# Altium project Segger_DebugBoard_v3.PrjPcb
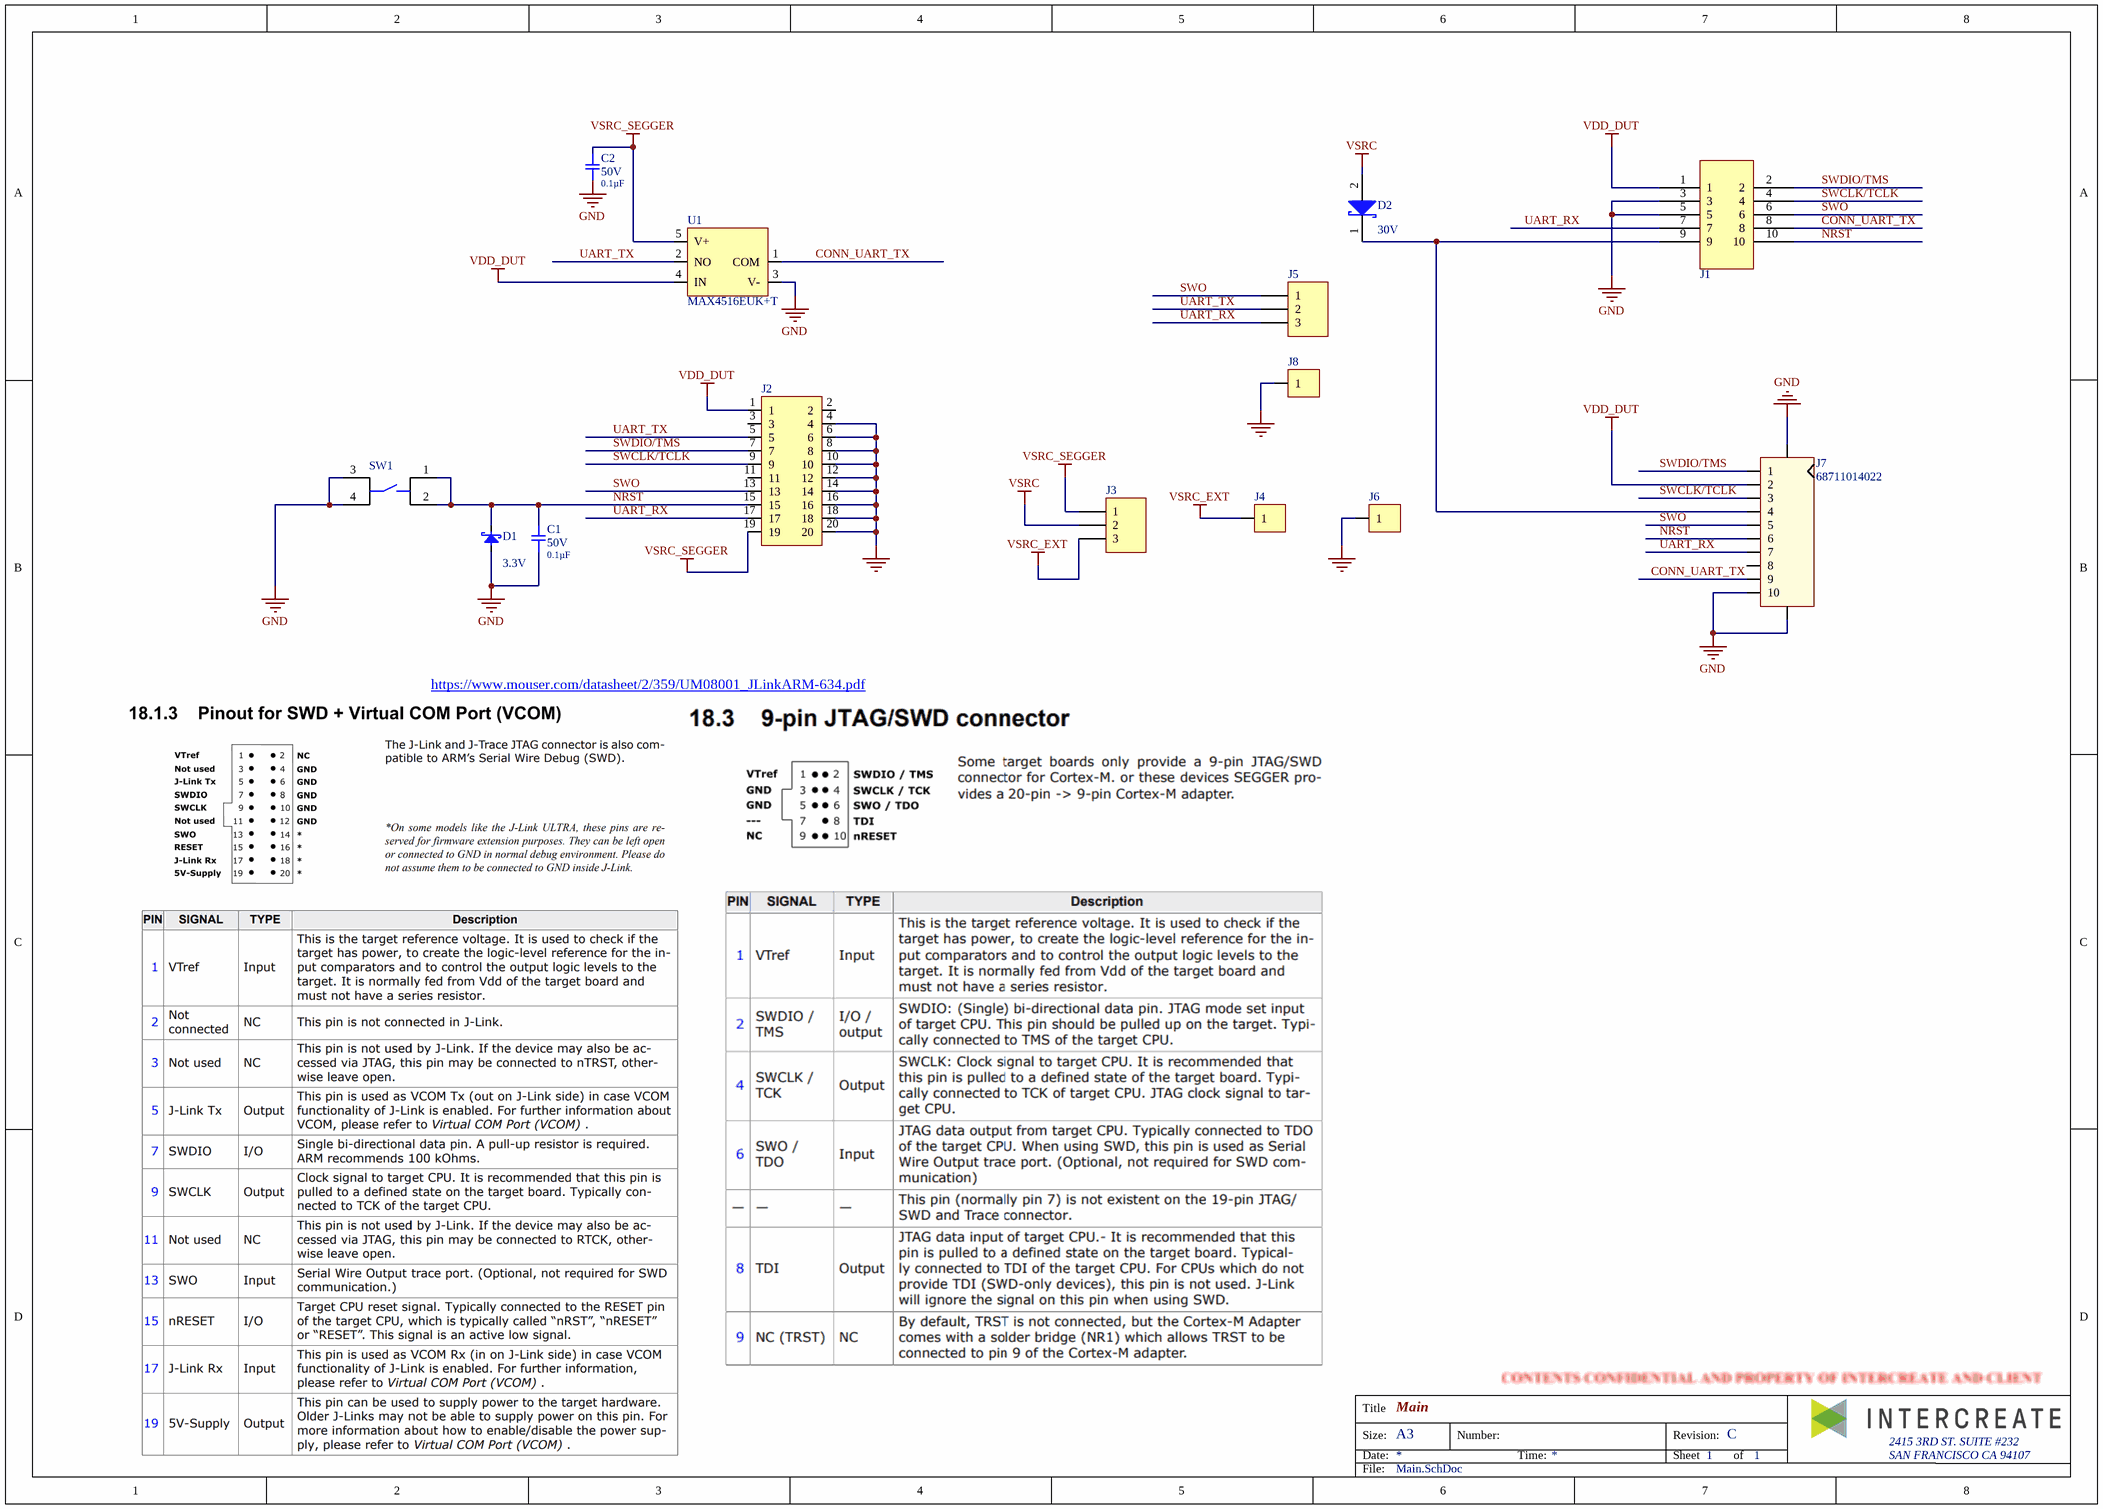
[diagram p0: Main.SchDoc]
Rev: C; ProjectName: Segger_DebugBoard
1 sheet, 14 parts. Net scope: global (net labels, ports and power ports of the same name join across sheets).
Board file: DebugBoard_v3.PcbDoc

## Sheet Main.SchDoc: Main
size A3; Organization: INTERCREATE; Address1: 2415 3RD ST. SUITE #232; Address2: SAN FRANCISCO CA 94107; Revision: C; SheetNumber: 1; SheetTotal: 1; ProjectName: KAGWERKS COMMAND CENTER

### Parts
C1  value 0.1µF  Voltage Rating: 50V  [CAP-0402]  (hidden comment: GCM155R71H104KE02D)
C2  value 0.1µF  Voltage Rating: 50V  [CAP-0402]  (hidden comment: GCM155R71H104KE02D)
D1  Reverse Standoff Voltage: 3.3V  [DIODE-SOD923f]  (hidden comment: CPDQ3V3U-HF)
D2  Reverse Voltage: 30V  [DIODE-SOD128]  (hidden comment: PMEG3010EP,115)
J1  FTSH-105-01-L-DV-K  [HDR-V-2X5-M]  (value not drawn)
J2  SFH11-PBPC-D10-ST-BK  [HDR-V-2X10-F-2.54MM]  (value not drawn)
J3  61300311121  [HDR-V-1X3]  (value not drawn)
J4  75160-101-01LF  [HDR-V-1X1-M]  (value not drawn)
J5  61300311121  [HDR-V-1X3]  (value not drawn)
J6  75160-101-01LF  [HDR-V-1X1-M]  (value not drawn)
J7  68711014022  [CONN-R-FPC-10P-WURTH]
J8  75160-101-01LF  [HDR-V-1X1-M]  (value not drawn)
SW1  PTS645SK50SMTR92 LFS  [BTN-SPST-PTS645SK50SMTR92]  (value not drawn)
U1  MAX4516EUK+T  [IC-SOT-23-5]

### Nets
GND: C1.1 C2.1 D1.2(A) J1.3 J1.5 J2.4 J2.6 J2.8 J2.10 J2.12 J2.14 J2.16 J2.18 J2.20 J6.1 J7.10 J7.ME1 J7.ME2 J8.1 SW1.3 SW1.4 U1.3(V-)
VDD_DUT: J1.1 J2.1 J7.2 U1.4(IN)
VSRC: D2.2(A) J3.2
VSRC_EXT: J3.3 J4.1
VSRC_SEGGER: C2.2 J2.19 J3.1 U1.5(V+)
CONN_UART_TX: J1.8 J7.9 U1.1(COM)
NRST: C1.2 D1.1(K) J1.10 J2.15 J7.6 SW1.1 SW1.2
SWCLK/TCLK: J1.4 J2.9 J7.3
SWDIO/TMS: J1.2 J2.7 J7.1
SWO: J1.6 J2.13 J5.1 J7.5
UART_RX: J1.7 J2.17 J5.3 J7.7
UART_TX: J2.5 J5.2 U1.2(NO)
NetD2_1: D2.1(K) J1.9 J7.4

Not connected (* = marked no-connect by the designer): J2 2 3 11; J7 8

### Notes on the sheet
- https://www.mouser.com/datasheet/2/359/UM08001_JLinkARM-634.pdf
- Title
- Size:
- Date:
- A3
- Number:
- Time:
- Revision:
- Sheet
- of
- File:

### Library data of the parts
C1 C2 = CAP-0.1uF-50V-0402: CAP CER 0.1UF 50V X7R 0402 10%; Manufacturer 1: Murata; Capacitance: 100nF; Supplier 1: Digi-Key; Manufacturer Part Number 1: GCM155R71H104KE02D; Stock 1: 254896; Pricing 1: 1=0.10000, 10=0.06100, 100=0.02730, 500=0.01952, 1000=0.01533, 2500=0.01394, 5000=0.01282 (USD); RoHS: Yes; Mount: Surface Mount; Case/Package: 0402; Weight: 0.000212oz; Case Code (Metric): 1005; Case Code (Imperial): 0402; Min Operating Temperature: -55°C; Max Operating Temperature: 125°C; Packaging: Tape and Reel; Dielectric: X7R; Tolerance: 10%; Termination: SMD/SMT; Voltage Rating (DC): 50V; Package Quantity: 10000; Length: 0.039inch; Height: 0.5mm; Width: 0.5mm; Thickness: 0.022inch; Ratings: AEC-Q200; REACH SVHC: No SVHC; Lead Free: Lead Free; ComponentLink1URL: http://www.mouser.com/ds/2/281/c03e-806517.pdf?src-supplier=Mouser; ComponentLink1Description: http://www.mouser.com/ds/2/281/c03e-806517.pdf?src-supplier=Mouser; ComponentLink2URL: http://www.farnell.com/datasheets/2079122.pdf?src-supplier=Farnell; ComponentLink2Description: http://www.farnell.com/datasheets/2079122.pdf?src-supplier=Farnell; ComponentLink3URL: http://www.farnell.com/datasheets/2079122.pdf?src-supplier=Newark; ComponentLink3Description: http://www.farnell.com/datasheets/2079122.pdf?src-supplier=Newark; ComponentLink4URL: http://www.farnell.com/datasheets/2079122.pdf?src-supplier=Element14; ComponentLink4Description: http://www.farnell.com/datasheets/2079122.pdf?src-supplier=Element14; ComponentLink5URL: http://search.murata.co.jp/Ceramy/image/img/A01X/partnumbering_e_02.pdf?src-supplier=Digi-Key; ComponentLink5Description: http://search.murata.co.jp/Ceramy/image/img/A01X/partnumbering_e_02.pdf?src-supplier=Digi-Key; Supplier Part Number 1: 490-10672-1-ND
D1 = DIODE-TVS-3.3V-SOD923F: TVS DIODE 3.3V 10.4V SOD923F; Manufacturer 1: Comchip; Min Breakdown Voltage: 5V; Clamping Voltage: 14.1V; Peak Pulse Power: 102W; Power Line Protection: No; Number of Channels: 1; Peak Pulse Current: 9.8A; Diode Type: ZENER; Supplier 1: Digi-Key; Manufacturer Part Number 1: CPDQ3V3U-HF; RoHS: Yes; Category: TVS Diodes; Stock 1: 9425; Pricing 1: 1=0.35000, 10=0.29000, 100=0.15360, 500=0.10106, 1000=0.06872, 2000=0.06199 (USD); Mount: Surface Mount; Min Operating Temperature: -55°C; Max Operating Temperature: 150°C; Packaging: Tape and Reel; Package Quantity: 8000; Breakdown Voltage: 5V; Termination: SMD/SMT; Series: -; Resistor Type: Zener; Number of Unidirectional Channels: 1; RoHS Compliant: Yes; ComponentLink1URL: https://datasheet.ciiva.com/6578/cpdq3v3u-hf-6578247.pdf?src-supplier=Digi-Key; ComponentLink1Description: https://datasheet.ciiva.com/6578/cpdq3v3u-hf-6578247.pdf?src-supplier=Digi-Key; ComponentLink2URL: https://datasheet.ciiva.com/12545/cpdq3v3u-hf-216634-12545533.pdf?src-supplier=Mouser; ComponentLink2Description: https://datasheet.ciiva.com/12545/cpdq3v3u-hf-216634-12545533.pdf?src-supplier=Mouser; Supplier Part Number 1: 641-1477-1-ND
D2 = DIODE-SCHOTTKY-30V-1A-SOD128: DIODE SCHOTTKY 30V 1A SOD128; Manufacturer 1: Nexperia USA Inc.; Speed: Fast Recovery =< 500ns, > 200mA (Io); Capacitance @ Vr, F: 170pF @ 1V, 1MHz; Supplier 1: Digi-Key; Manufacturer Part Number 1: PMEG3010EP,115; RoHS: RoHS Compliant; Category: Discrete Semiconductor Products; Stock 1: 0; Pricing 1: 3000=0.11556, 6000=0.10856, 15000=0.10155, 30000=0.09338 (USD); Packaging: Tape & Reel (TR); Part Status: Active; Diode Type: Schottky; Current - Average Rectified (Io): 1A; Mounting Type: Surface Mount; Package / Case: SOD-128; Supplier Device Package: CFP5; Operating Temperature - Junction: 150°C (Max); Base Part Number: PMEG3010; ComponentLink1URL: https://assets.nexperia.com/documents/data-sheet/PMEG3010EP.pdf; ComponentLink1Description: https://assets.nexperia.com/documents/data-sheet/PMEG3010EP.pdf; Supplier Part Number 1: 1727-5408-1-ND
J1 = HDR-V-2X5-M-JTAG: CONN HEADER 10 POS DUAL .05" SMD; Manufacturer: Samtec; Max Current Rating: 1.75A; Number of Positions: 10; Gender: Male; Connector Type: Male Pin; Pitch: 1.27mm; Row Spacing: 0.05inch; Supplier 1: Digi-Key; Stock 1: 7189; Pricing 1: 1=3.13, 10=3, 100=2.5, 500=2.125, 1000=1.8125, 5000=1.625 (USD); Mount: Surface Mount; Contact Material: Bronze; Contact Plating: Nickel,Gold; Colour: Black; Housing Colour: Black; Housing Material: Polymer; Min Operating Temperature: -55°C; Max Operating Temperature: 125°C; Number of Rows: 2; Package Quantity: 1; Packaging: Rail/Tube; Termination: Solder; Number of Contacts: 10; Orientation: Straight; Length: 6.35mm; Contact Mating Length: 0.12inch; Depth: 3.43mm; Radiation Hardening: No; REACH SVHC: No SVHC; Lead Free: Lead Free; ComponentLink1URL: https://datasheet.ciiva.com/728/ftsh-1xx-xx-xxx-dv-xxx-mkt-728872.pdf; ComponentLink1Description: https://datasheet.ciiva.com/728/ftsh-1xx-xx-xxx-dv-xxx-mkt-728872.pdf; ComponentLink2URL: https://datasheet.ciiva.com/10245/ftsh-mt-10245272.pdf; ComponentLink2Description: https://datasheet.ciiva.com/10245/ftsh-mt-10245272.pdf; ComponentLink3URL: https://datasheet.ciiva.com/16657/ftsh-mt-16657372.pdf; ComponentLink3Description: https://datasheet.ciiva.com/16657/ftsh-mt-16657372.pdf; ComponentLink4URL: https://datasheet.ciiva.com/22703/ftsh-smt-22703900.pdf; ComponentLink4Description: https://datasheet.ciiva.com/22703/ftsh-smt-22703900.pdf; ComponentLink5URL: https://datasheet.ciiva.com/26936/getdatasheetpartid-175877-26936879.pdf; ComponentLink5Description: https://datasheet.ciiva.com/26936/getdatasheetpartid-175877-26936879.pdf; Supplier Part Number 1: SAM8799-ND; MPN: FTSH-105-01-L-DV-K; Manufacturer 1: Samtec; Manufacturer Part Number 1: FTSH-105-01-L-DV-K
J2 = HDR-V-2X10-F-2.54MM: 20 Position Header Connector 0.100" (2.54mm) Through Hole Gold; Manufacturer 1: Sullins; Number of Positions: 20; Pitch: 0.1inch; Supplier 1: Digi-Key; Manufacturer Part Number 1: SFH11-PBPC-D10-ST-BK; RoHS: Yes; Category: Headers and Wire Housings; Stock 1: 51703; Pricing 1: 1=1.15000, 10=0.96800, 80=0.86925, 440=0.71118, 1000=0.63216, 5000=0.57070 (USD); Mount: Through Hole; Color: Black; Contact Plating: Gold; Package Quantity: 1; Number of Rows: 2; Packaging: Tray; Termination: Solder; Connector Type: Header; Series: SFH11; Contact Type: Female Socket; Row Spacing: 0.1inch; Lead Free: Lead Free; RoHS Compliant: Yes; ComponentLink1URL: https://datasheet.ciiva.com/754/sfh11-pxxc-dxx-st-xx11160-c-754558.pdf?src-supplier=Digi-Key; ComponentLink1Description: https://datasheet.ciiva.com/754/sfh11-pxxc-dxx-st-xx11160-c-754558.pdf?src-supplier=Digi-Key; Supplier Part Number 1: S9197-ND
J3 J5 = HDR-V-1X3-M: Header, 3-Pin, 0.1"; Manufacturer: Wurth Electronics; Number of Positions: 3; Gender: Male; Connector Type: Male Pin; Pitch: 0.1inch; LatestRevisionDate: 17-Jul-2002; LatestRevisionNote: Re-released for DXP Platform.; Publisher: Altium Limited; Supplier 1: Digi-Key; MPN: 61300311121; Stock 1: 41782; Pricing 1: 1=0.13, 10=0.106, 25=0.088, 50=0.074, 100=0.067, 1000=0.061 (USD); Mount: Through Hole; Contact Plating: Gold; Contact Material: Copper; Colour: Black; Number of Rows: 1; Packaging: Bulk; Termination: Solder; Number of Contacts: 3; Contact Mating Length: 0.236inch; REACH SVHC: Unknown; Lead Free: Lead Free; ComponentLink1URL: http://www.farnell.com/cad/1737268.pdf; ComponentLink1Description: http://www.farnell.com/cad/1737268.pdf; ComponentLink2URL: http://katalog.we-online.de/em/datasheet/6130xx11121.pdf; ComponentLink2Description: http://katalog.we-online.de/em/datasheet/6130xx11121.pdf; Supplier Part Number 1: 732-5316-ND; Manufacturer 1: Wurth Electronics; Manufacturer Part Number 1: 61300311121
J4 J6 J8 = HDR-V-1X1-M: BergStik®, Board to Board connector, Unshrouded vertical header, through hole, single Row, 1 position, 2.54mm pitch; Manufacturer 1: Amphenol ICC / FCI; Current Rating: 3A; Voltage Rating: 1.5kV; Number of Positions: 1; Insulation Resistance: 5GR; Gender: Male; Connector Type: Male Pin; Supplier 1: Mouser; Manufacturer Part Number 1: 75160-101-01LF; RoHS: Yes; Category: Connectors; Stock 1: 4529; Pricing 1: 1=0.36000, 10=0.27000, 50=0.27000, 100=0.21400, 1000=0.16800, 10000=0.12900 (USD); Mounting Technology: Through Hole; Contact Plating: Gold,GXT; Contact Material: Bronze; Color: Black; Housing Color: Black; Housing Material: Thermoplastic; Number of Rows: 1; Package Quantity: 1000; Packaging: Bulk; Contact Gender: Male; Termination: Solder; Number of Contacts: 1; Orientation: Straight; Series: BERGSTIK®, MezzSelect™, Basics+; Contact Type: Male Pin; Length: 2.54mm; Contact Mating Length: 0.225inch; Pitch: 2.54mm; Contact Post Length: 2.54mm; Depth: 2.8mm; Radiation Hardening: No; ComponentLink1URL: https://datasheet.ciiva.com/29149/75160-29149349.pdf?src-supplier=Digi-Key; ComponentLink1Description: https://datasheet.ciiva.com/29149/75160-29149349.pdf?src-supplier=Digi-Key; Supplier Part Number 1: 649-75160-101-01LF
J7 = CONN-R-FPC-10P-0.5MM-WURTH: CONN FFC FPC 10POS 0.50MM RA; Manufacturer 1: Wurth Electronics; Manufacturer Part Number 1: 68711014022
SW1 = BTN-SPST-PTS645SK50SMTR92: C & K COMPONENTS - PTS645SK50SMTR92LFS - SWITCH, SPST, 0.05A, 12VDC, SMD, 5MM; Manufacturer 1: ITT C&K; Mechanical Life: 100000Cycles; Actuator Material: Nylon,Polyamide,PA66; Operating Force: 260gf; Max Voltage Rating (DC): 12V; Current Rating: 50mA; Contact Resistance: 100mR; Illumination Type: Non-Illuminated,Illuminated; Switch Function: Off-Mom; Actuator Type: Standard; Actuator Length: 1.55mm; Supplier 1: Digi-Key; Manufacturer Part Number 1: PTS645SK50SMTR92LFS; RoHS: Yes; Category: Tactile Switches; Stock 1: 52601; Pricing 1: 1=0.15000, 10=0.14900, 25=0.14120, 100=0.12840, 250=0.12068, 500=0.11042 (USD); Mount: Surface Mount; Case/Package: SMD/SMT; Contact Plating: Silver; Contact Material: Bronze; Color: Red; Min Operating Temperature: -20°C; Max Operating Temperature: 60°C; Packaging: Tape and Reel; Throw Configuration: SPST; Termination: Gull Wing; Voltage Rating (DC): 12V; Package Quantity: 1; Max Current Rating: 50mA; Orientation: Straight; Series: PTS645; Length: 6mm; Depth: 9mm; REACH SVHC: No SVHC; Lead Free: Lead Free; RoHS Compliant: Yes; ComponentLink1URL: https://datasheet.ciiva.com/29903/getdatasheetpartid-741134-29903854.pdf?src-supplier=Verical; ComponentLink1Description: https://datasheet.ciiva.com/29903/getdatasheetpartid-741134-29903854.pdf?src-supplier=Verical; ComponentLink2URL: https://datasheet.ciiva.com/14920/pts645-14920581.pdf?src-supplier=Digi-Key; ComponentLink2Description: https://datasheet.ciiva.com/14920/pts645-14920581.pdf?src-supplier=Digi-Key; ComponentLink3URL: https://datasheet.ciiva.com/22637/1707731-22637358.pdf?src-supplier=Element14; ComponentLink3Description: https://datasheet.ciiva.com/22637/1707731-22637358.pdf?src-supplier=Element14; Supplier Part Number 1: CKN9087CT-ND
U1 = IC-SW-MAX4516: MAX4516 Series SPST-NO 6V 20 Ohm SMT Analog Switch - SOT-23; Manufacturer 1: Maxim; Max Power Dissipation: 571mW; Min Dual Supply Voltage: 1V; On-State Resistance: 20R; Operating Supply Current: 40uA; Turn-On Delay Time: 100ns; Turn-Off Delay Time: 75ns; Max Supply Current: 125uA; Throw Configuration: SPST; Supply Type: Dual; Operating Supply Voltage: 5V; Number of Channels: 1; Supplier 1: Newark; Manufacturer Part Number 1: MAX4516EUK+T; RoHS: Yes; Category: Decoders and Multiplexers; Stock 1: 1593; Pricing 1: 1=2.88000, 10=2.60000, 25=2.45000, 50=2.27000, 100=2.09000, 250=1.96000, 500=1.71000, 1000=1.47000 (USD); Mounting Technology: Surface Mount; Case/Package: SOT-23-5; Pins: 5; Weight: 0.001058oz; Min Operating Temperature: -40°C; Max Operating Temperature: 85°C; Max Dual Supply Voltage: 6V; Packaging: Tape and Reel; Package Quantity: 1; Series: -; Dual Supply Voltage: 5V; Radiation Hardening: No; RoHS Compliant: Yes; ComponentLink1URL: https://datasheet.ciiva.com/1673/max4516-max4517-1673360.pdf?src-supplier=Digi-Key; ComponentLink1Description: https://datasheet.ciiva.com/1673/max4516-max4517-1673360.pdf?src-supplier=Digi-Key; ComponentLink2URL: https://datasheet.ciiva.com/1673/max4516-max4517-1673359.pdf?src-supplier=Digi-Key; ComponentLink2Description: https://datasheet.ciiva.com/1673/max4516-max4517-1673359.pdf?src-supplier=Digi-Key; ComponentLink3URL: https://datasheet.ciiva.com/1673/max4516-max4517-1673343.pdf?src-supplier=Digi-Key; ComponentLink3Description: https://datasheet.ciiva.com/1673/max4516-max4517-1673343.pdf?src-supplier=Digi-Key; ComponentLink4URL: https://datasheet.ciiva.com/2979/max4516-max4517-2979725.pdf?src-supplier=Avnet; ComponentLink4Description: https://datasheet.ciiva.com/2979/max4516-max4517-2979725.pdf?src-supplier=Avnet; Supplier Part Number 1: 73Y4225

## Assembly variants
Mfg: all parts fitted